# Altium schematic sheet THS7002CPWP_Schematic_2.SchDoc
size A; SheetNumber: 15; SheetTotal: 15
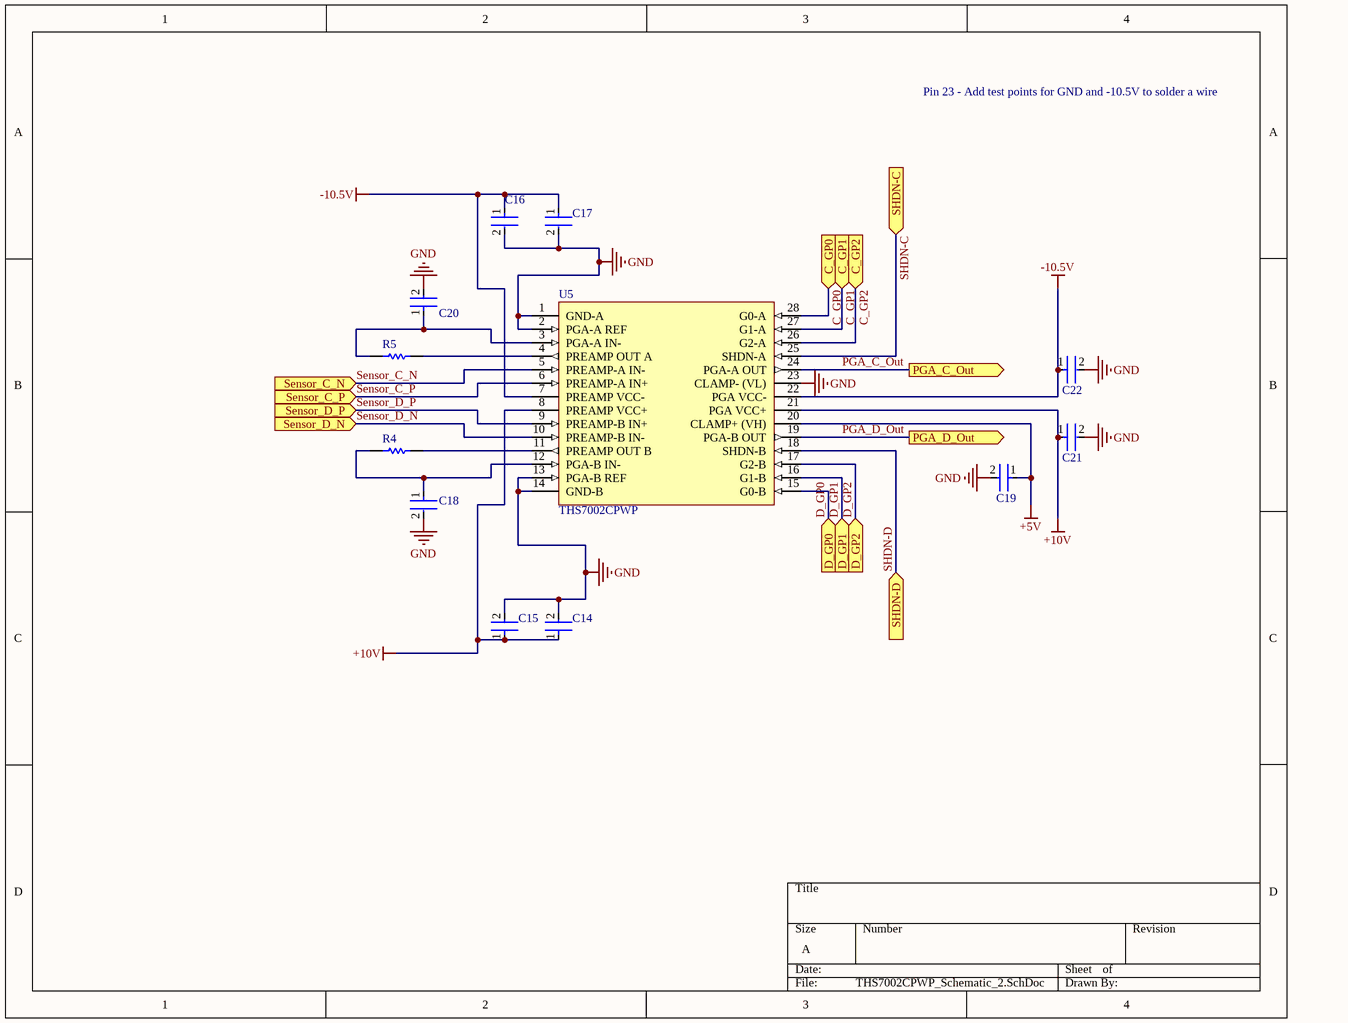
[diagram p0: THS7002CPWP_Schematic_2.SchDoc]

## Parts
C14  C2012JB1A685K060AC  [FP-C2012-060-0_2-IPC_A]  (value not drawn)
C15  CC0603KRX7R7BB104  [FP-CC0603-DA-MFG]  (value not drawn)
C16  CC0603KRX7R7BB104  [FP-CC0603-DA-MFG]  (value not drawn)
C17  C2012JB1A685K060AC  [FP-C2012-060-0_2-IPC_A]  (value not drawn)
C18  GRM3195C1H163JA01D  [FP-GRM319-0_15-IPC_A]  (value not drawn)
C19  C2012JB1A685K060AC  [FP-C2012-060-0_2-IPC_A]  (value not drawn)
C20  GRM3195C1H163JA01D  [FP-GRM319-0_15-IPC_A]  (value not drawn)
C21  C2012JB1A685K060AC  [FP-C2012-060-0_2-IPC_A]  (value not drawn)
C22  C2012JB1A685K060AC  [FP-C2012-060-0_2-IPC_A]  (value not drawn)
R4  CRCW08050000Z0EA  [RESC2013X50X30LL20T20]  (value not drawn)
R5  CRCW08050000Z0EA  [RESC2013X50X30LL20T20]  (value not drawn)
U5  THS7002CPWP  [PWP0028E_M]

## Ports
C_GP0 (in), C_GP1 (in), C_GP2 (in), D_GP0 (in), D_GP1 (in), D_GP2 (in), PGA_C_Out (out), PGA_D_Out (out), Sensor_C_N (in), Sensor_C_P (in), Sensor_D_N (in), Sensor_D_P (in), SHDN-C (in), SHDN-D (in)

## Nets
+5V: C19.1 U5.20(CLAMP+_(VH))
+10V: C14.1 C15.1 C21.1 U5.8(PREAMP_VCC+) U5.21(PGA_VCC+)
-10.5V: C16.1 C17.1 C22.1 U5.7(PREAMP_VCC-) U5.22(PGA_VCC-)
GND: C14.2 C15.2 C16.2 C17.2 C18.2 C19.2 C20.2 C21.2 C22.2 U5.1(GND-A) U5.2(PGA-A_REF) U5.13(PGA-B_REF) U5.14(GND-B) U5.23(CLAMP-_(VL))
C_GP0: U5.28(G0-A) ; port C_GP0
C_GP1: U5.27(G1-A) ; port C_GP1
C_GP2: U5.26(G2-A) ; port C_GP2
D_GP0: U5.15(G0-B) ; port D_GP0
D_GP1: U5.16(G1-B) ; port D_GP1
D_GP2: U5.17(G2-B) ; port D_GP2
PGA_C_Out: U5.24(PGA-A_OUT) ; port PGA_C_Out
PGA_D_Out: U5.19(PGA-B_OUT) ; port PGA_D_Out
Sensor_C_N: U5.5(PREAMP-A_IN-) ; port Sensor_C_N
Sensor_C_P: U5.6(PREAMP-A_IN+) ; port Sensor_C_P
Sensor_D_N: U5.10(PREAMP-B_IN-) ; port Sensor_D_N
Sensor_D_P: U5.9(PREAMP-B_IN+) ; port Sensor_D_P
SHDN-C: U5.25(SHDN-A) ; port SHDN-C
SHDN-D: U5.18(SHDN-B) ; port SHDN-D
NetC18_1: C18.1 R4.1 U5.12(PGA-B_IN-)
NetC20_1: C20.1 R5.1 U5.3(PGA-A_IN-)
NetR4_2: R4.2 U5.11(PREAMP_OUT_B)
NetR5_2: R5.2 U5.4(PREAMP_OUT_A)

## Notes on the sheet
- Pin 23 - Add test points for GND and -10.5V to solder a wire

## Library data of the parts
C14 C17 C19 C21 C22 = CMP-08246-004641-1: Multilayer Ceramic Capacitors 6.8μF ±10% 10V JB SMD 0805; Capacitance: 6.8uF; RoHS Compliant: Yes; Case Code (Metric): 5032; Case/Package: 0805; Voltage Rating: 10V; Width: 0.049inch; Min Operating Temperature: -25°C; Mount: Surface Mount; Voltage Rating (DC): 10V; Dielectric Material: Ceramic; Case Code (Imperial): 2012; Package Quantity: 4000; Lead Free: Lead Free; Packaging: Tape and Reel; Length: 0.079inch; Tolerance: 10%; Thickness: 0.028inch; Max Operating Temperature: 85°C; Series: C
C15 C16 = CMP-2000-05002-2: CAP CER 0.1UF 16V X7R 0603; Manufacturer: YAGEO; Tolerance: 0.1; Value: 100 nF; Temperature Coefficient: 15%; Material: Ceramic; Voltage Rating: 16 V; Package: CC0603-DA; ComponentLink2Description: Datasheet; Octopart: https://octopart.com/cc0603krx7r7bb104-yageo-192941; Temperature Range High: +125°C; Digikey Description: CAP CER 0.1UF 16V X7R 0603; Voltage: 16 V; Device Class L2: Capacitors; Height: 0.9mm; Temperature: -55°C to +125°C; Manufacturer Part Number: CC0603KRX7R7BB104; Device Class L1: Passive Components; Device Class L3: Ceramic Capacitors; ComponentLink2URL: http://www.yageo.com/documents/recent/UPY-GPHC_X7R_6.3V-to-50V_18.pdf; Footprint Url: http://www.yageo.com/exep/pages/download/literatures/UPY-C_GEN_24.pdf; RoHS: TRUE; Temperature Range Low: -55°C; Temperature Characteristic: X7R; Lead Free: Yes; Capacitance: 100 nF; Category: Cap; Mouser Description: Multilayer Ceramic Capacitor, CC Series, 0.1 - F, - 10%, X7R, 16 V, 0603 [1608 Metric]; Automotive: No
C18 C20 = CMP-06035-007665-1: Chip Multilayer Ceramic Capacitors for General Purpose, 1206, 16000pF, C0G, 30ppm/°C, 5%, 50V; Capacitance: 16nF; Tolerance: 5%; Case Code (Metric): 3216; Length: 3.2mm; Package Quantity: 4000; Mount: Surface Mount; Voltage Rating (DC): 50V; Voltage Rating: 50V; Case Code (Imperial): 1206; Height: 0.85mm; Min Operating Temperature: -55°C; Max Operating Temperature: 125°C; Termination: SMD/SMT; Width: 0.063inch; Radiation Hardening: No; Depth: 1.6mm; Thickness: 0.037inch; Dielectric: C0G; Case/Package: 1206; Packaging: Tape and Reel
R4 R5 = CMP-2001-04896-1: Manufacturer: Vishay Dale; Part Number: CRCW08050000Z0EA
U5 = CMP-0988-00132-2: 70-MHz High-Speed Programmable-Gain Amplifier, Dual, 0 to 70 degC, 28-pin SOP (PWP28), Green (RoHS & no Sb/Br); Manufacturer: Texas Instruments; Disable: TRUE; BW @ Acl(MHz): 100; Vs(Min)(V): 9; Vs(Max)(V): 32; Number of Channels: 2; Vio(Max)(mV): 7; Iib(Max)(nA): 6000; SubFamily: Variable Gain Amplifier; Vn at Flatband(Typ)(nV/rtHz): 1.7; Slew Rate(Typ)(V/us): 85; ComponentLink1Description: Manufacturer URL; Code_JEDEC: MO-153; PackageVersion: 4073225-6/I, 05/2011; PackageReference: PWP0028E; Eco-Plan: Green (RoHS & no Sb/Br); ComponentLink2URL: http://www.ti.com/general/docs/lit/getliterature.tsp?genericPartNumber=THS7002&fileType=pdf; PackageDescription: 28-Pin Plastic Small Outline, Body 4.4 x 9.7 mm, Pitch 0.65 mm; DatasheetVersion: SLOS214C; ComponentLink3URL: http://www.ti.com/litv/pdf/mpds373; ComponentLink3Description: Package Specification; ComponentLink1URL: http://www.ti.com/; ComponentLink2Description: Datasheet; Mounting Technology: Surface Mount; PartNumber: THS7002CPWP